# Altium schematic sheet var_09_scheme.SchDoc
size A4; SheetNumber: 9; SheetTotal: 10
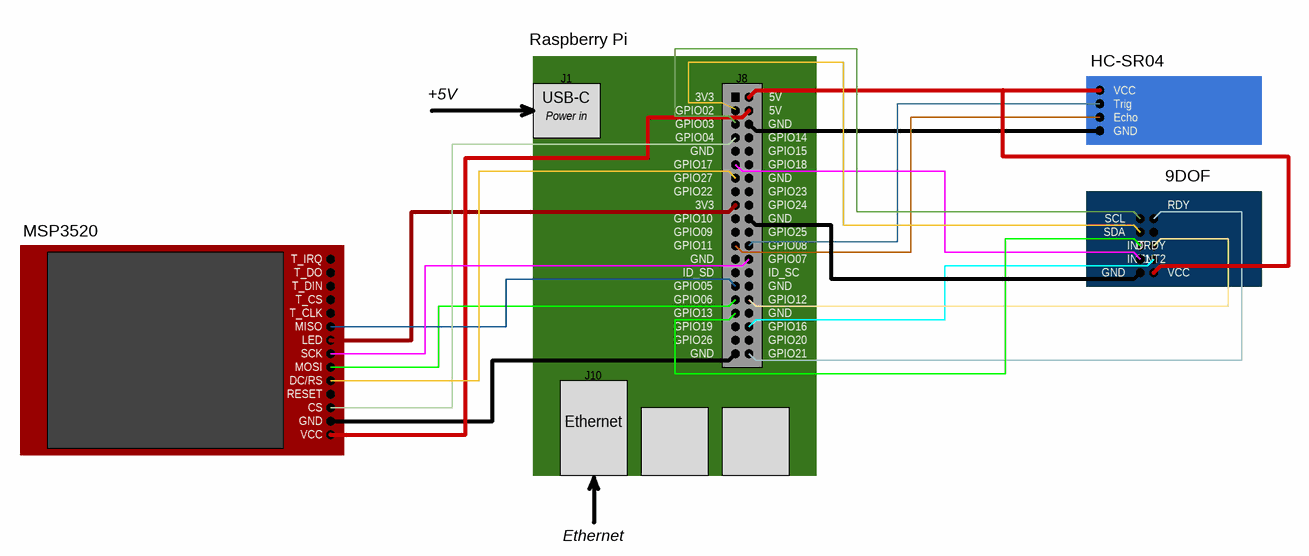
[diagram p0: var_09_scheme.SchDoc]

## Notes on the sheet
- Raspberry Pi
- HC-SR04
- +5V
- USB-C
- Power in
- J1
- 3V3
- GPIO02
- GPIO03
- J8
- GND
- 5V
- VCC
- Trig
- Echo
- GPIO17
- GPIO27
- GPIO22
- GPIO04
- GPIO14
- GPIO15
- GPIO18
- GPIO23
- 9DOF
- MSP3520
- T_IRQ
- GPIO09
- GPIO10
- GPIO11
- GPIO24
- GPIO25
- GPIO08
- GPIO07
- SCL
- SDA
- INT
- INT1
- RDY
- DRDY
- INT2
- T_DO
- T_DIN
- T_CS
- T_CLK
- MISO
- GPIO05
- GPIO06
- GPIO13
- GPIO19
- ID_SD
- ID_SC
- GPIO12
- GPIO16
- RESET
- DC/RS
- MOSI
- SCK
- LED
- J10
- GPIO26
- GPIO20
- GPIO21
- CS
- Ethernet